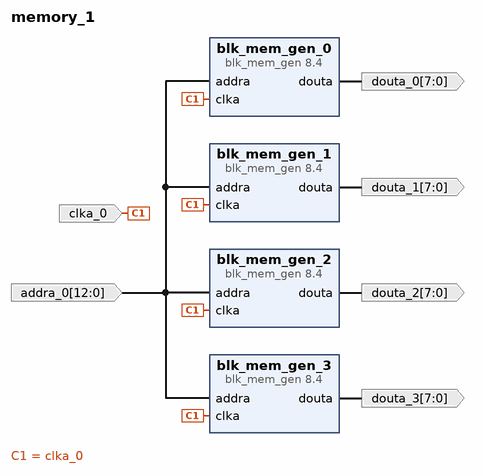
[diagram p0: block diagram of the top level]
# Vivado block design memory_1, xc7z010clg400-1, Vivado 2023.1
create_bd_design memory_1

create_bd_port -dir I -type clk clka_0
create_bd_port -dir I -from 12 -to 0 addra_0
create_bd_port -dir O -from 7 -to 0 douta_0
create_bd_port -dir O -from 7 -to 0 douta_1
create_bd_port -dir O -from 7 -to 0 douta_2
create_bd_port -dir O -from 7 -to 0 douta_3

create_bd_cell -type ip -vlnv xilinx.com:ip:blk_mem_gen:8.4 blk_mem_gen_0
set_property -dict [list \
  CONFIG.Coe_File file_dout_0.coe \
  CONFIG.Enable_A Always_Enabled \
  CONFIG.Load_Init_File true \
  CONFIG.Register_PortA_Output_of_Memory_Primitives false \
  CONFIG.Write_Width_A 8 \
  CONFIG.use_bram_block Stand_Alone \
] [get_bd_cells blk_mem_gen_0]
create_bd_cell -type ip -vlnv xilinx.com:ip:blk_mem_gen:8.4 blk_mem_gen_1
set_property -dict [list \
  CONFIG.Coe_File file_dout_1.coe \
  CONFIG.Enable_A Always_Enabled \
  CONFIG.Load_Init_File true \
  CONFIG.Register_PortA_Output_of_Memory_Primitives false \
  CONFIG.Write_Width_A 8 \
  CONFIG.use_bram_block Stand_Alone \
] [get_bd_cells blk_mem_gen_1]
create_bd_cell -type ip -vlnv xilinx.com:ip:blk_mem_gen:8.4 blk_mem_gen_2
set_property -dict [list \
  CONFIG.Coe_File file_dout_2.coe \
  CONFIG.Enable_A Always_Enabled \
  CONFIG.Load_Init_File true \
  CONFIG.Register_PortA_Output_of_Memory_Primitives false \
  CONFIG.Write_Width_A 8 \
  CONFIG.use_bram_block Stand_Alone \
] [get_bd_cells blk_mem_gen_2]
create_bd_cell -type ip -vlnv xilinx.com:ip:blk_mem_gen:8.4 blk_mem_gen_3
set_property -dict [list \
  CONFIG.Coe_File file_dout_3.coe \
  CONFIG.Enable_A Always_Enabled \
  CONFIG.Load_Init_File true \
  CONFIG.Register_PortA_Output_of_Memory_Primitives false \
  CONFIG.Write_Width_A 8 \
  CONFIG.use_bram_block Stand_Alone \
] [get_bd_cells blk_mem_gen_3]

# ---- connections ----

connect_bd_net -net addra_0_1 [get_bd_ports addra_0] \
  [get_bd_pins blk_mem_gen_0/addra] [get_bd_pins blk_mem_gen_1/addra] [get_bd_pins blk_mem_gen_2/addra] \
  [get_bd_pins blk_mem_gen_3/addra]
connect_bd_net [get_bd_pins blk_mem_gen_0/douta] [get_bd_ports douta_0]
connect_bd_net [get_bd_pins blk_mem_gen_1/douta] [get_bd_ports douta_1]
connect_bd_net [get_bd_pins blk_mem_gen_2/douta] [get_bd_ports douta_2]
connect_bd_net [get_bd_pins blk_mem_gen_3/douta] [get_bd_ports douta_3]
connect_bd_net -net clka_0_1 [get_bd_ports clka_0] \
  [get_bd_pins blk_mem_gen_0/clka] [get_bd_pins blk_mem_gen_3/clka] [get_bd_pins blk_mem_gen_2/clka] \
  [get_bd_pins blk_mem_gen_1/clka]

validate_bd_design
save_bd_design
